# Altium schematic sheet QSPI.SchDoc: QSPI
size A4; DocumentNumber: MB1144; Revision: C-02; SheetNumber: 13; SheetTotal: 25; Project: STM32L476G-EVAL; ModifiedDate: 9/23/2015
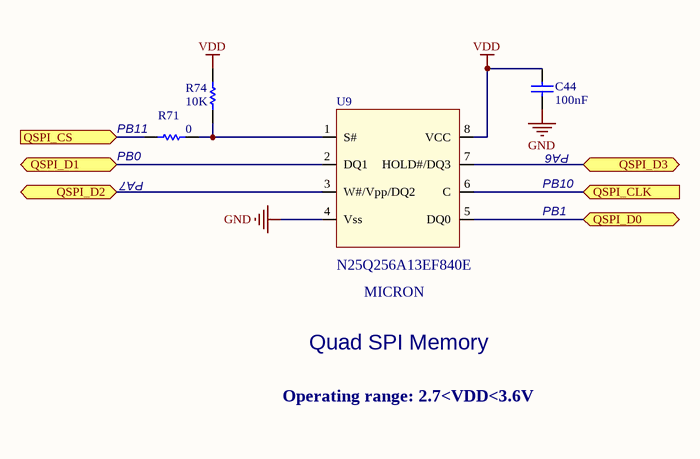
[diagram p0: QSPI.SchDoc]

## Parts
C44  100nF  [0402C]
R71  0  [0603R]
R74  10K  [0402R]
U9  N25Q256A13EF840E  [DFN8_1R27_6X8_TP4R8X5R8]

## Ports
QSPI_CLK (in), QSPI_CS (in), QSPI_D0 (bidir), QSPI_D1 (bidir), QSPI_D2 (bidir), QSPI_D3 (bidir)

## Nets
GND: C44.2 U9.4(Vss)
VDD: C44.1 R74.1 U9.8(VCC)
QSPI_CLK: U9.6(C) ; port QSPI_CLK
QSPI_CS: R71.2 ; port QSPI_CS
QSPI_D0: U9.5(DQ0) ; port QSPI_D0
QSPI_D1: U9.2(DQ1) ; port QSPI_D1
QSPI_D2: U9.3(W#/Vpp/DQ2) ; port QSPI_D2
QSPI_D3: U9.7(HOLD#/DQ3) ; port QSPI_D3
NetR71_1: R71.1 R74.2 U9.1(S#)

## Notes on the sheet
- (near R71) PB0
- (near R71) PB11
- PA6
- (near R71) PA7
- PB1
- PB10
- MICRON
- Quad SPI Memory
- Operating range: 2.7<VDD<3.6V
- Title:
- Project:
- Size:
- Date:
- A4
- Reference:
- Sheet:
- Revision:
- of

## Library data of the parts
C44 = Cap: Capacitor; Value: 10nF; Ordered by: Subcon; ECCN_US/EU: NA; Published: 8-Jun-2000; Revision: July-2002: Re-released for DXP Platform.; Publisher: Altium Limited
R71 = Res1: Resistor; Value: 1K; Ordered by: Subcon; ECCN_US/EU: NA; Published: 8-Jun-2000; Revision: July-2002: Re-released for DXP Platform.; Publisher: Altium Limited
R74 = res1: Resistor; Value: 1K; Ordered by: Subcon; ECCN_US/EU: NA; Published: 8-Jun-2000; Revision: July-2002: Re-released for DXP Platform.; Publisher: Altium Limited
U9 = QSPI_8pins: Manuf_1: Micron; ECCN_US/EU: 3A991; Ordered by: Subcon; Manuf_Part_1: N25Q256A13EF840E